# EAGLE schematic LEDtable (EAGLE 7.5.0)
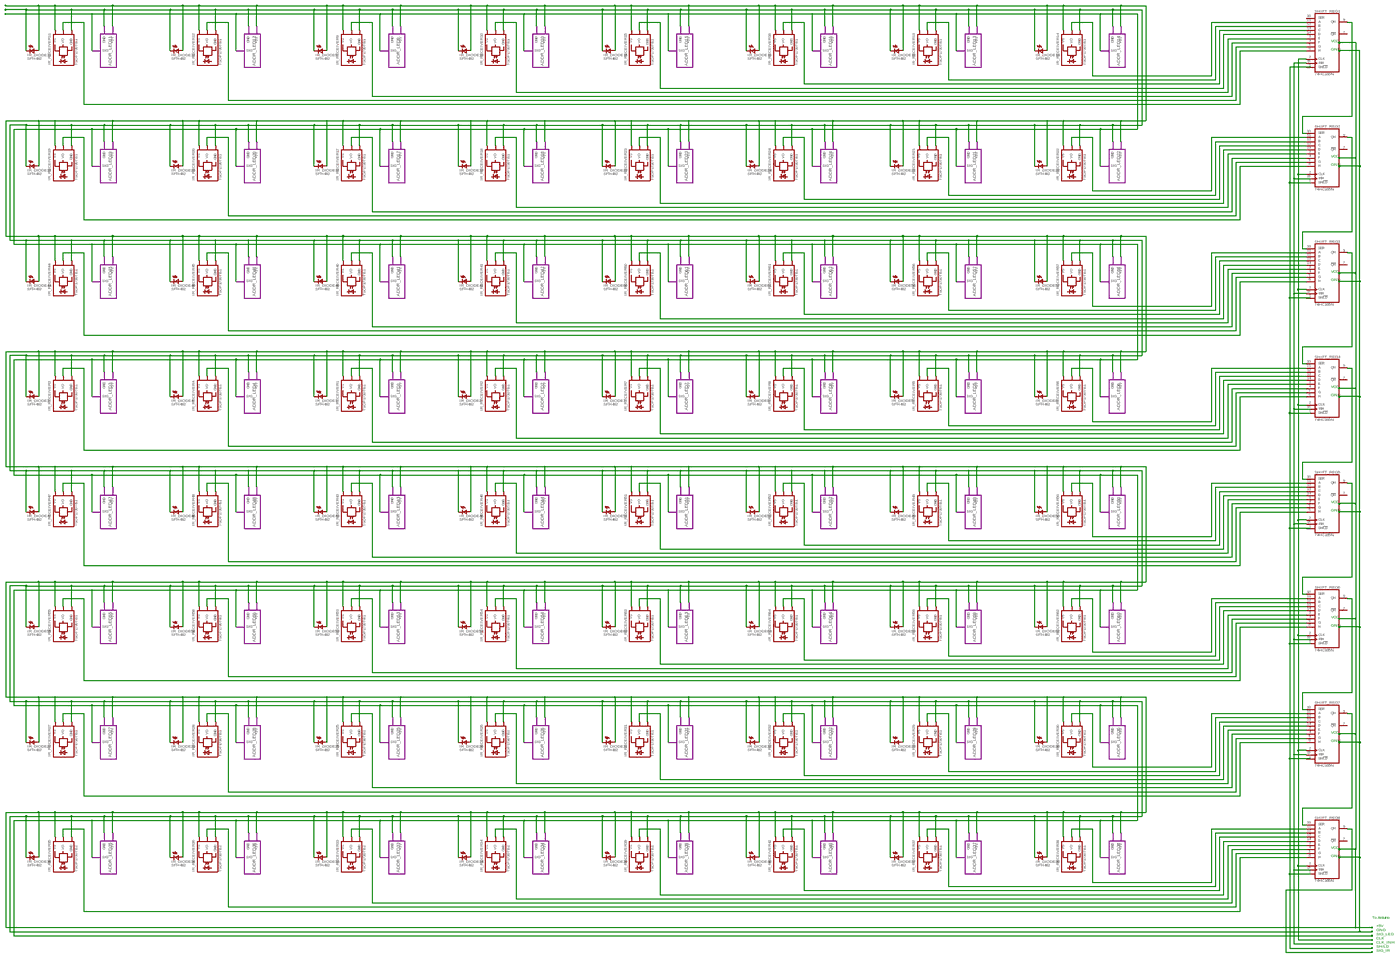
[diagram p0: schematic, sheet 1, overview]
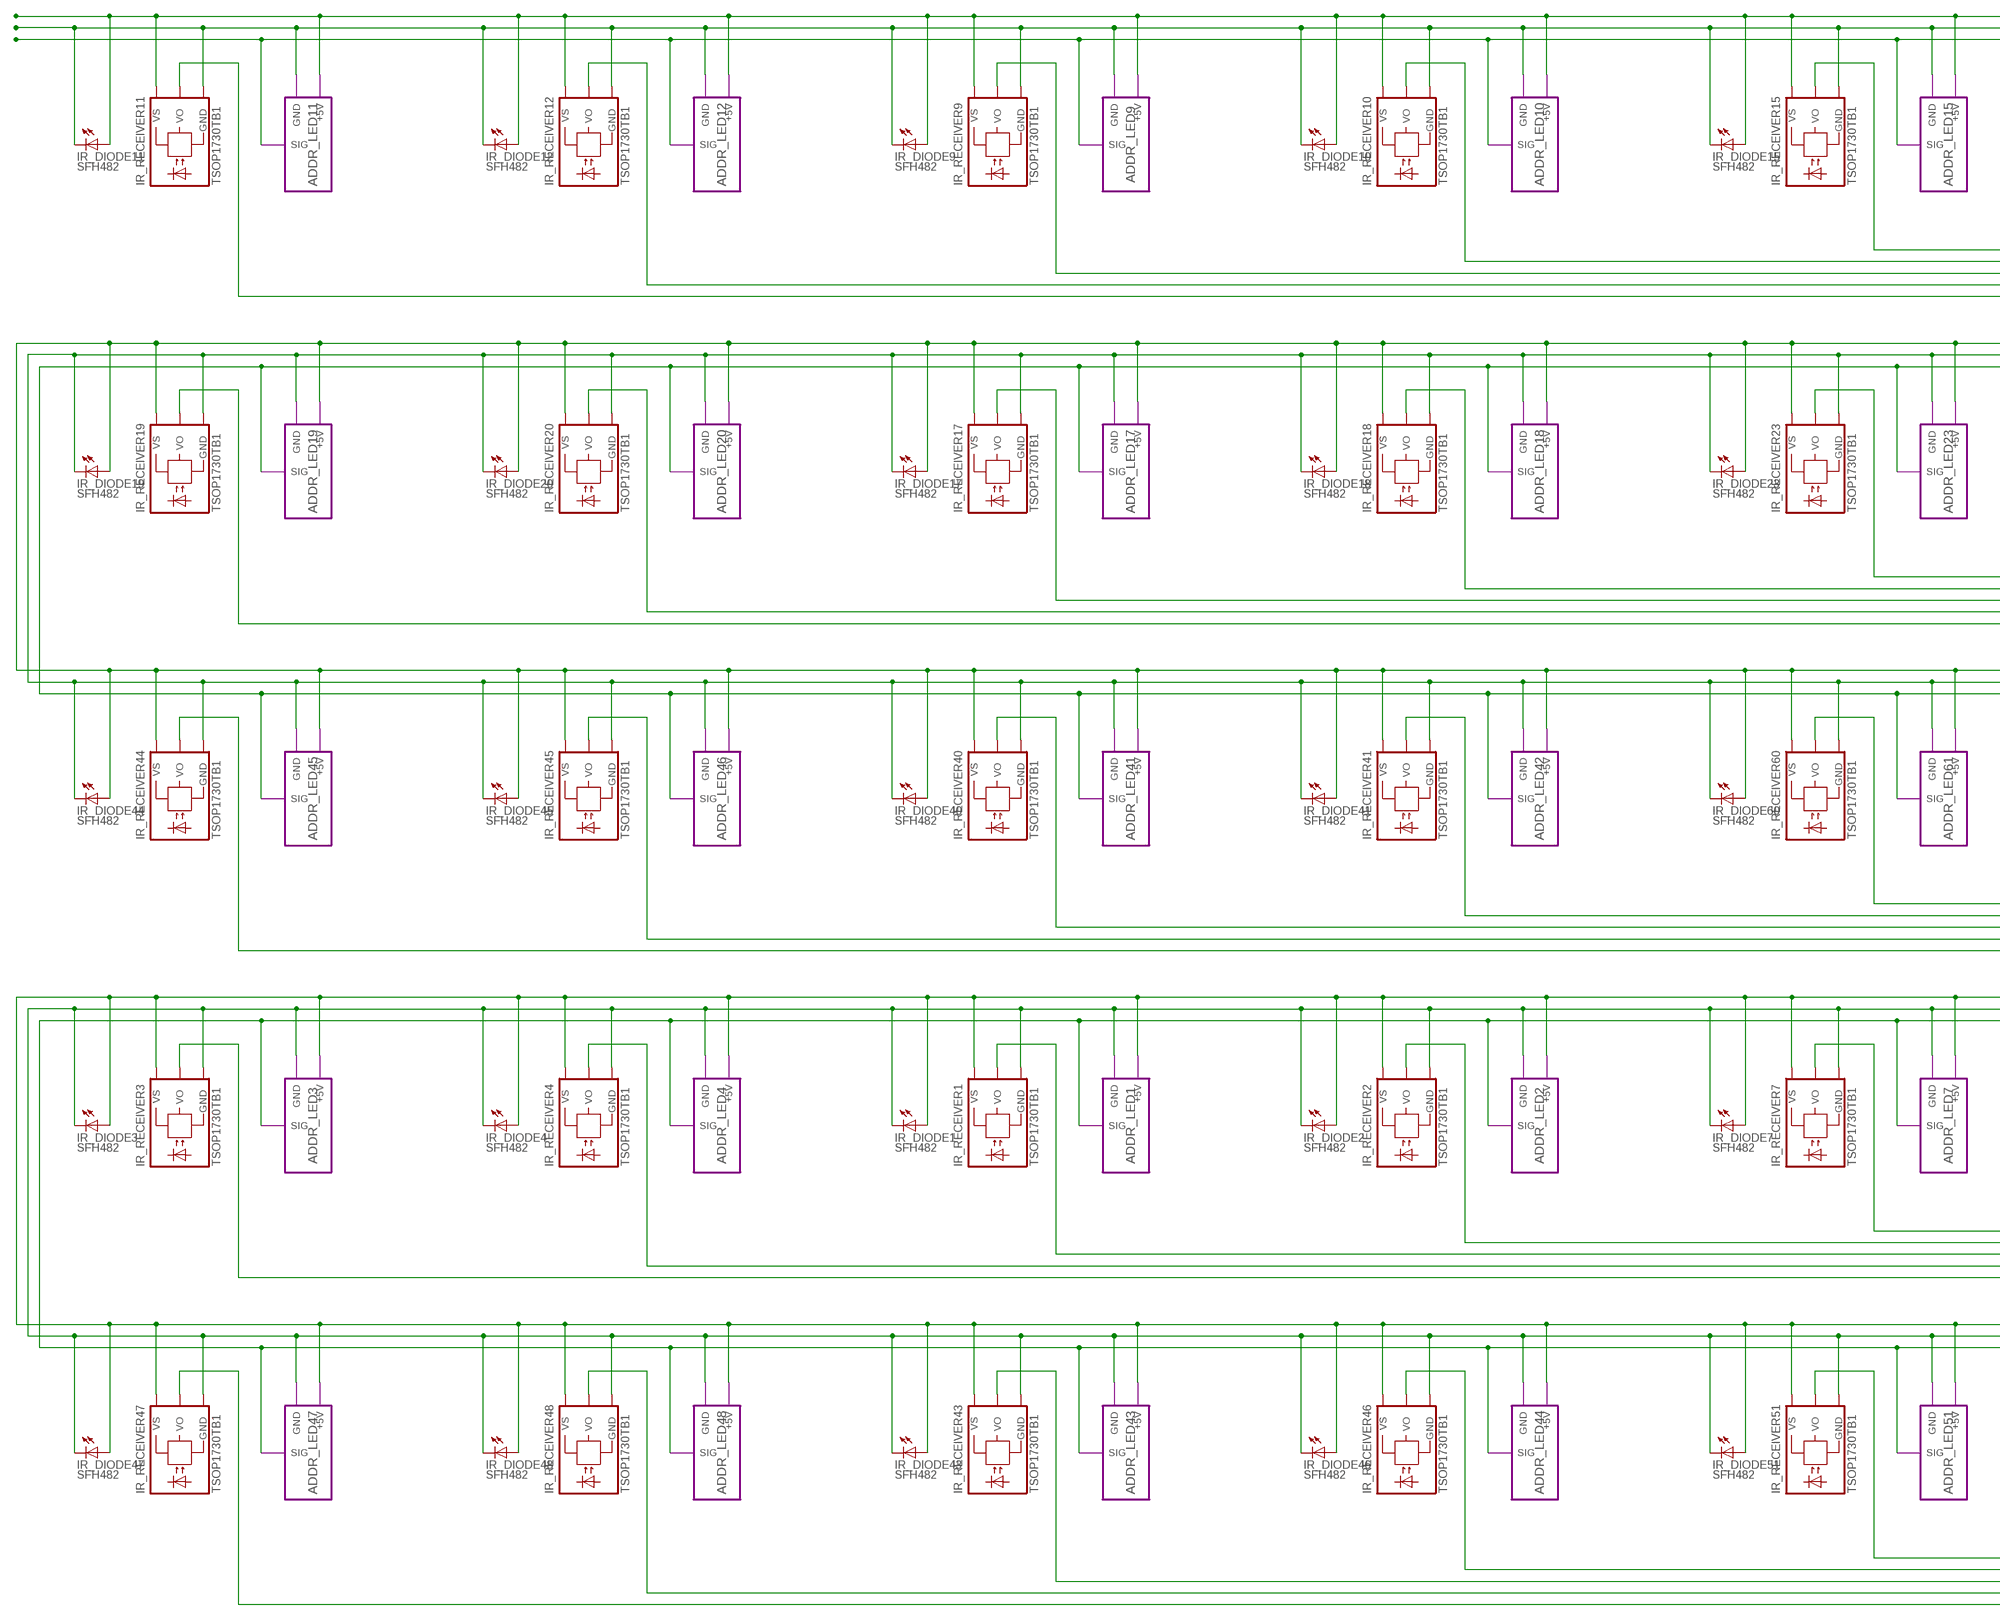
[diagram p1: schematic, sheet 1, part 1 of 4]
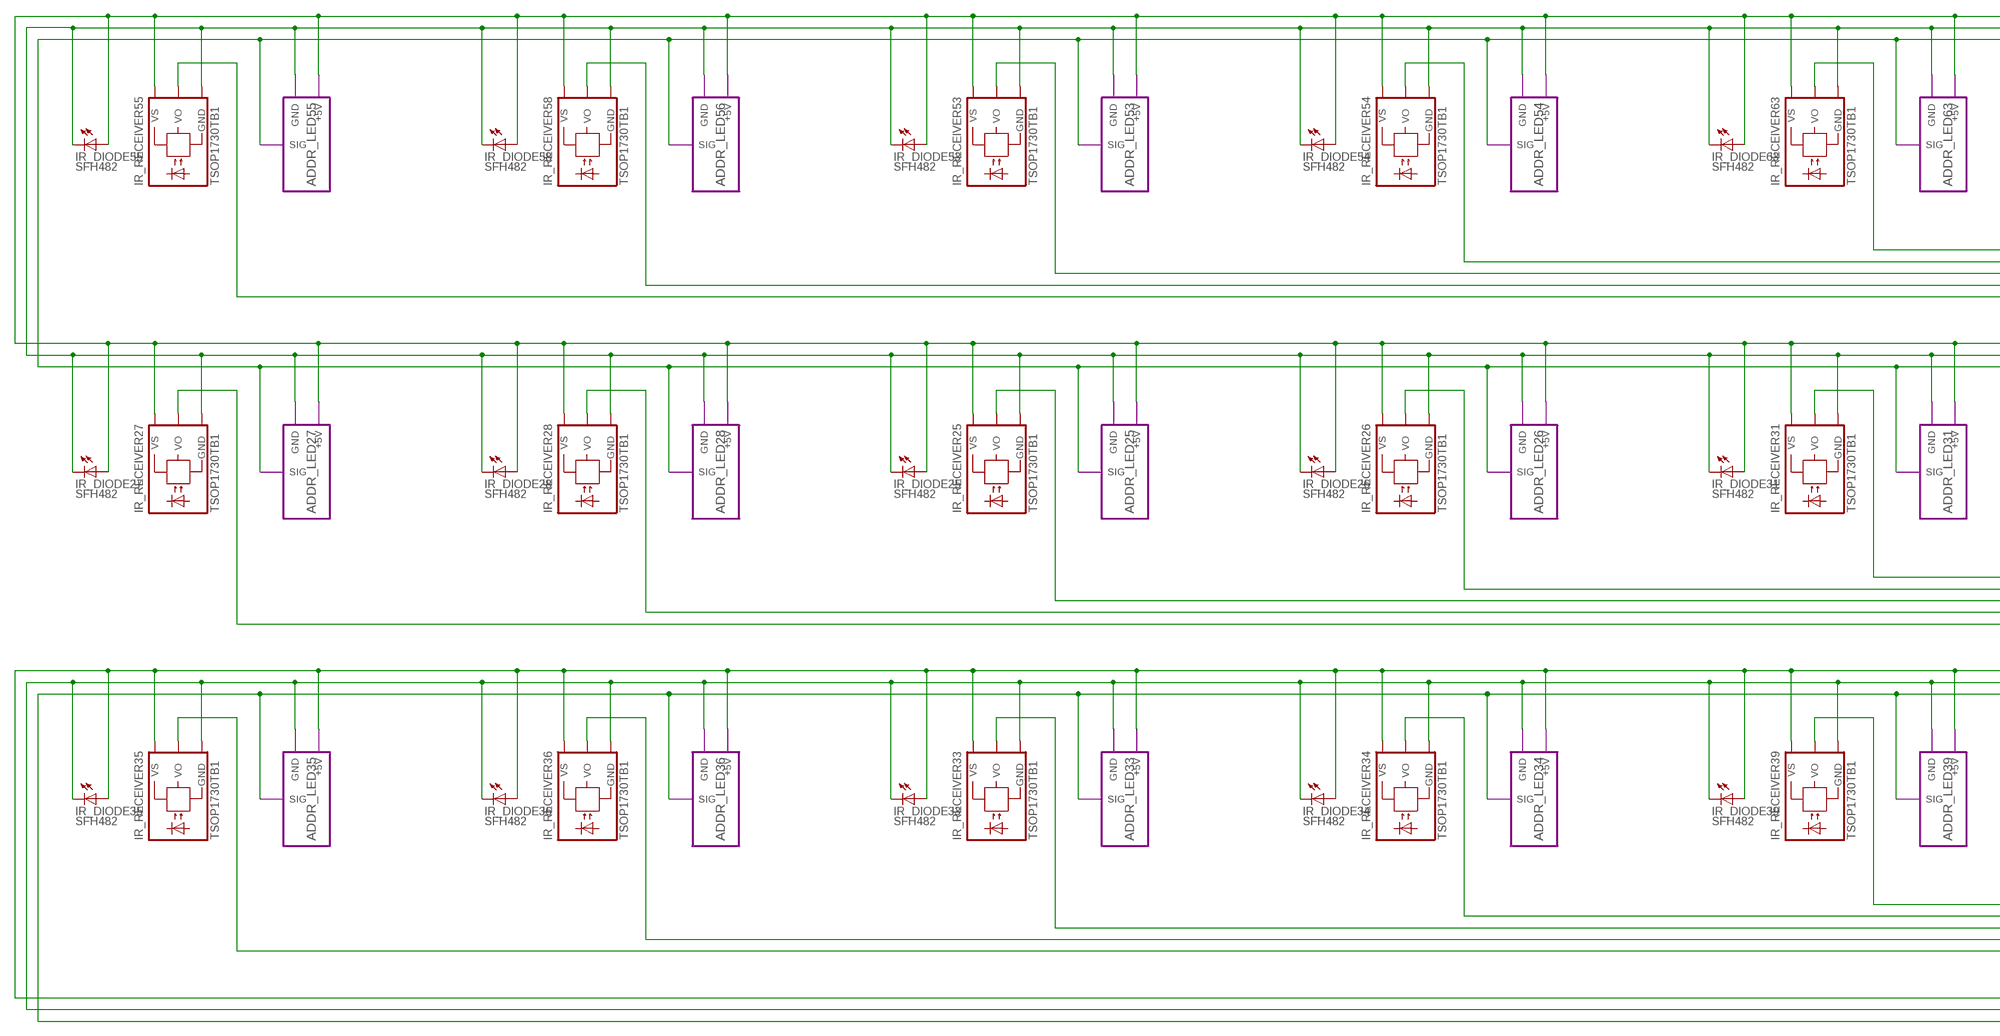
[diagram p2: schematic, sheet 1, part 2 of 4]
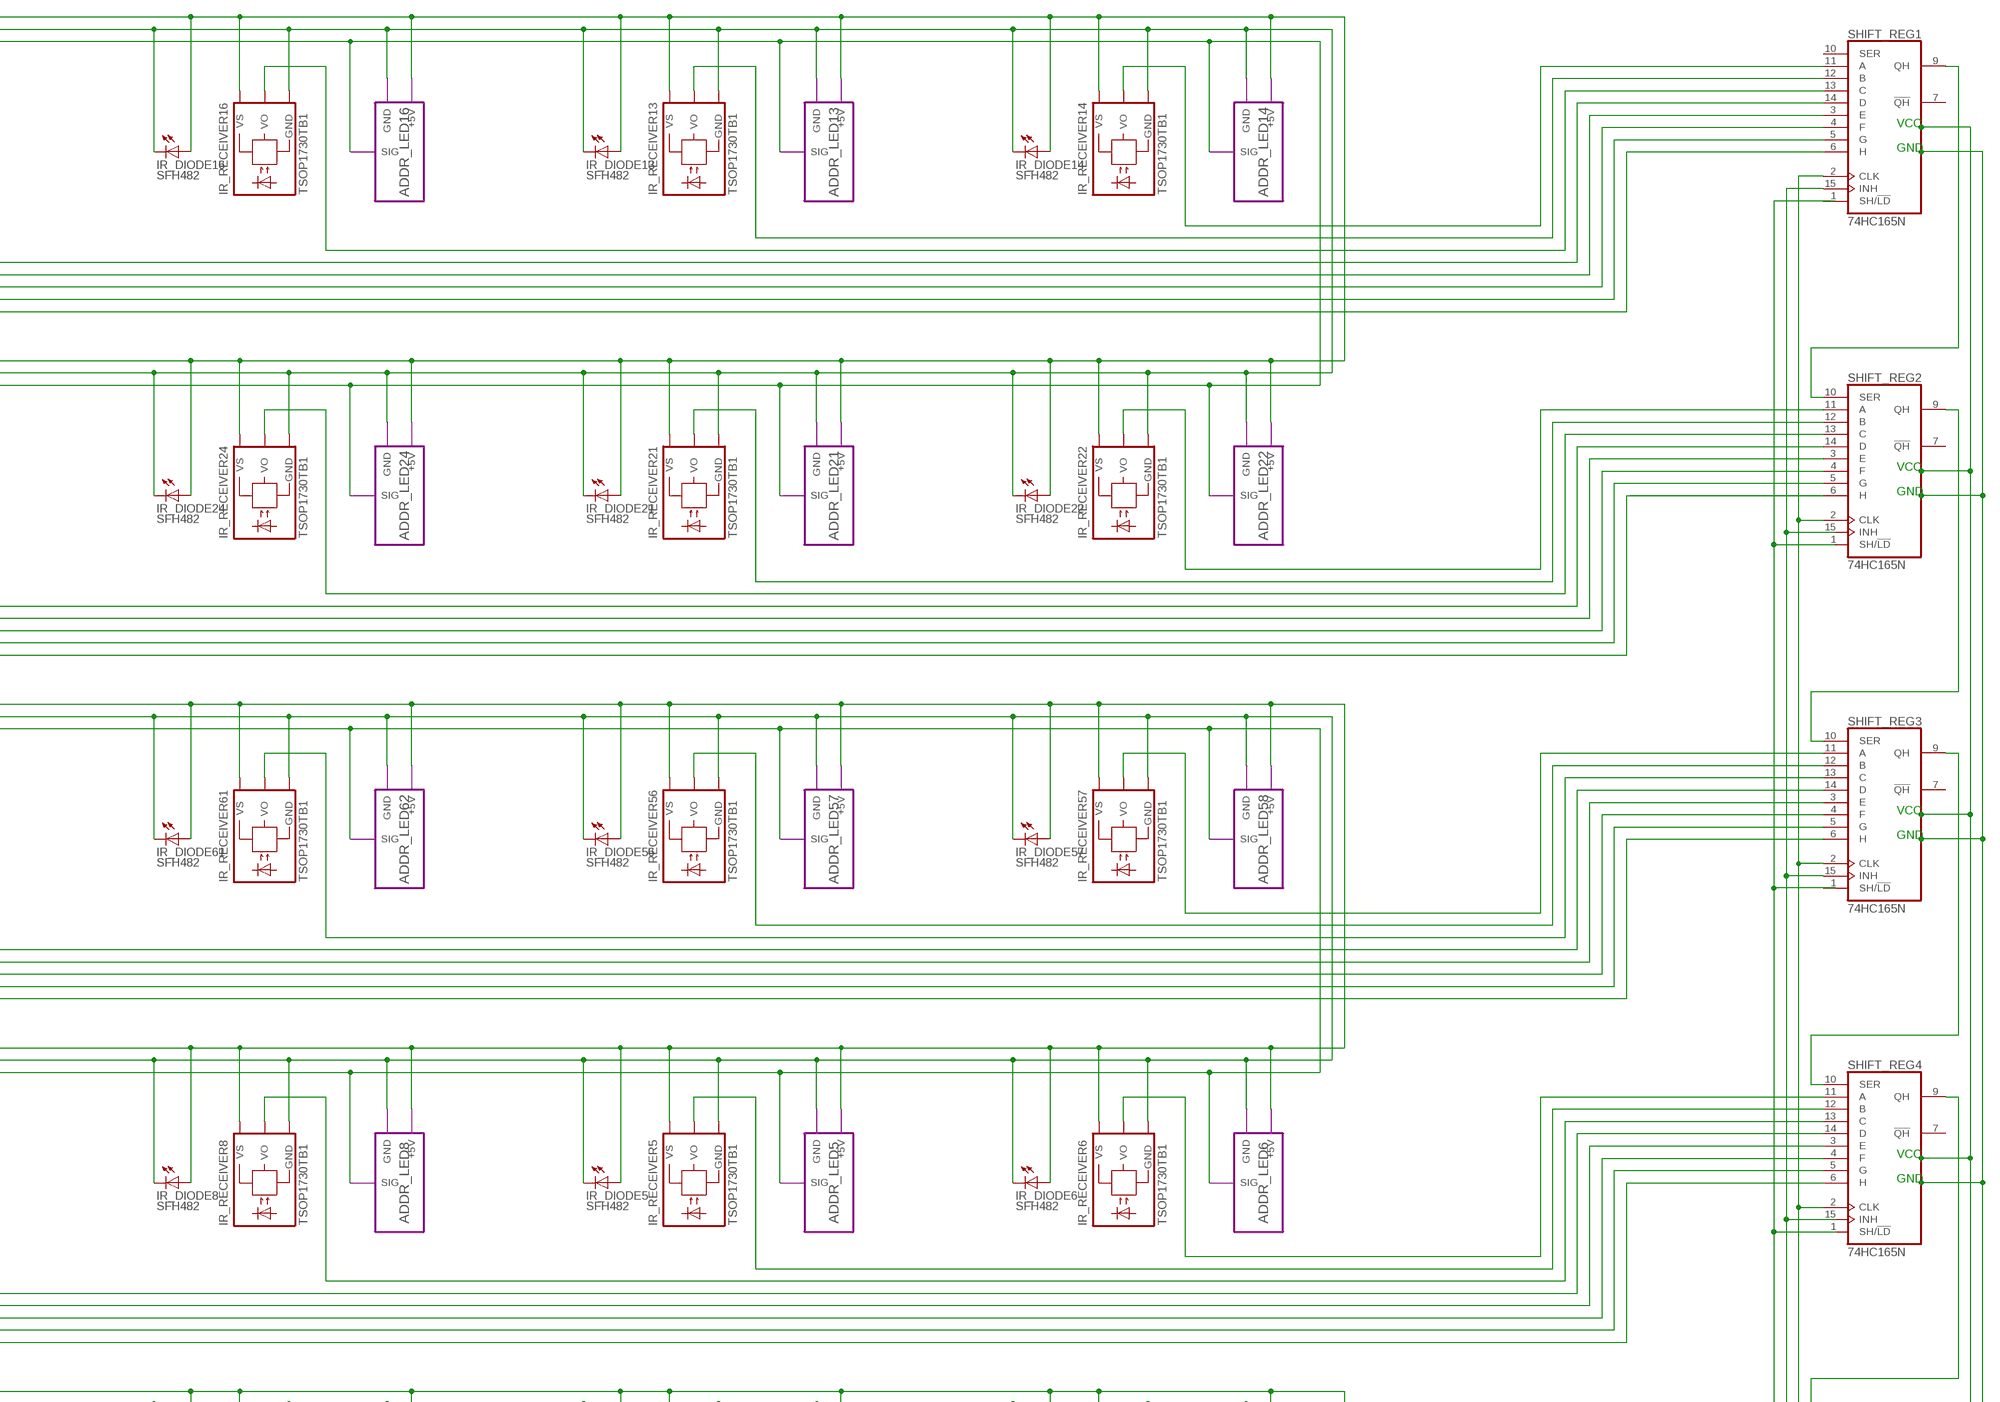
[diagram p3: schematic, sheet 1, part 3 of 4]
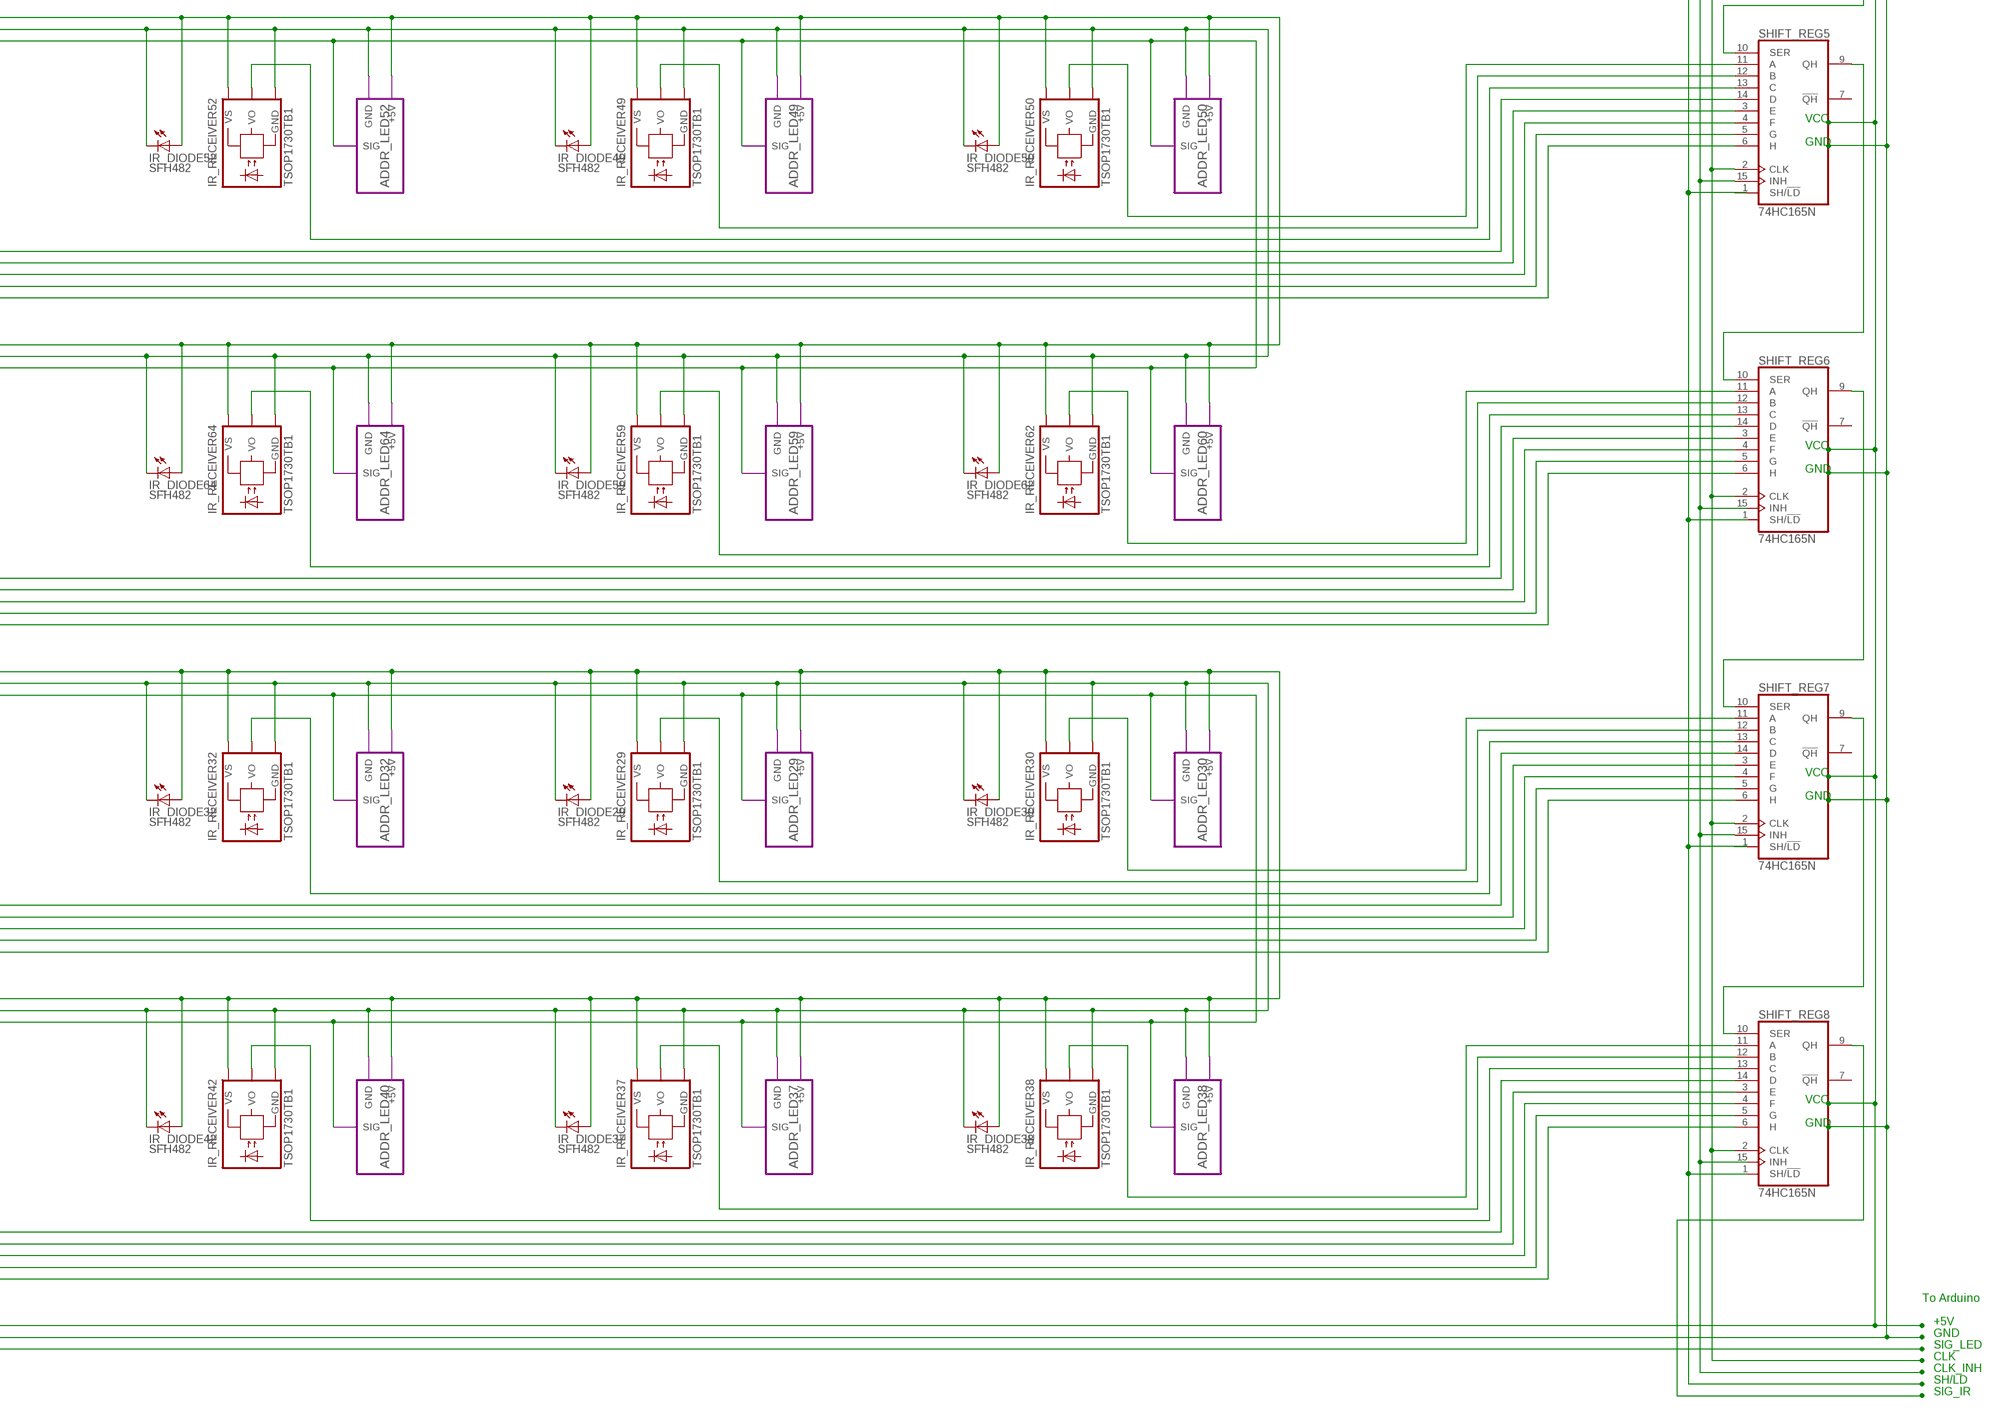
[diagram p4: schematic, sheet 1, part 4 of 4]

## Parts
IR_DIODE1  SFH482  [SFH482]
IR_DIODE2  SFH482  [SFH482]
IR_DIODE3  SFH482  [SFH482]
IR_DIODE4  SFH482  [SFH482]
IR_DIODE5  SFH482  [SFH482]
IR_DIODE6  SFH482  [SFH482]
IR_DIODE7  SFH482  [SFH482]
IR_DIODE8  SFH482  [SFH482]
IR_DIODE9  SFH482  [SFH482]
IR_DIODE10  SFH482  [SFH482]
IR_DIODE11  SFH482  [SFH482]
IR_DIODE12  SFH482  [SFH482]
IR_DIODE13  SFH482  [SFH482]
IR_DIODE14  SFH482  [SFH482]
IR_DIODE15  SFH482  [SFH482]
IR_DIODE16  SFH482  [SFH482]
IR_DIODE17  SFH482  [SFH482]
IR_DIODE18  SFH482  [SFH482]
IR_DIODE19  SFH482  [SFH482]
IR_DIODE20  SFH482  [SFH482]
IR_DIODE21  SFH482  [SFH482]
IR_DIODE22  SFH482  [SFH482]
IR_DIODE23  SFH482  [SFH482]
IR_DIODE24  SFH482  [SFH482]
IR_DIODE25  SFH482  [SFH482]
IR_DIODE26  SFH482  [SFH482]
IR_DIODE27  SFH482  [SFH482]
IR_DIODE28  SFH482  [SFH482]
IR_DIODE29  SFH482  [SFH482]
IR_DIODE30  SFH482  [SFH482]
IR_DIODE31  SFH482  [SFH482]
IR_DIODE32  SFH482  [SFH482]
IR_DIODE33  SFH482  [SFH482]
IR_DIODE34  SFH482  [SFH482]
IR_DIODE35  SFH482  [SFH482]
IR_DIODE36  SFH482  [SFH482]
IR_DIODE37  SFH482  [SFH482]
IR_DIODE38  SFH482  [SFH482]
IR_DIODE39  SFH482  [SFH482]
IR_DIODE40  SFH482  [SFH482]
IR_DIODE41  SFH482  [SFH482]
IR_DIODE42  SFH482  [SFH482]
IR_DIODE43  SFH482  [SFH482]
IR_DIODE44  SFH482  [SFH482]
IR_DIODE45  SFH482  [SFH482]
IR_DIODE46  SFH482  [SFH482]
IR_DIODE47  SFH482  [SFH482]
IR_DIODE48  SFH482  [SFH482]
IR_DIODE49  SFH482  [SFH482]
IR_DIODE50  SFH482  [SFH482]
IR_DIODE51  SFH482  [SFH482]
IR_DIODE52  SFH482  [SFH482]
IR_DIODE53  SFH482  [SFH482]
IR_DIODE54  SFH482  [SFH482]
IR_DIODE55  SFH482  [SFH482]
IR_DIODE56  SFH482  [SFH482]
IR_DIODE57  SFH482  [SFH482]
IR_DIODE58  SFH482  [SFH482]
IR_DIODE59  SFH482  [SFH482]
IR_DIODE60  SFH482  [SFH482]
IR_DIODE61  SFH482  [SFH482]
IR_DIODE62  SFH482  [SFH482]
IR_DIODE63  SFH482  [SFH482]
IR_DIODE64  SFH482  [SFH482]
IR_RECEIVER1  TSOP1730TB1  [TSOP17_TB1]
IR_RECEIVER2  TSOP1730TB1  [TSOP17_TB1]
IR_RECEIVER3  TSOP1730TB1  [TSOP17_TB1]
IR_RECEIVER4  TSOP1730TB1  [TSOP17_TB1]
IR_RECEIVER5  TSOP1730TB1  [TSOP17_TB1]
IR_RECEIVER6  TSOP1730TB1  [TSOP17_TB1]
IR_RECEIVER7  TSOP1730TB1  [TSOP17_TB1]
IR_RECEIVER8  TSOP1730TB1  [TSOP17_TB1]
IR_RECEIVER9  TSOP1730TB1  [TSOP17_TB1]
IR_RECEIVER10  TSOP1730TB1  [TSOP17_TB1]
IR_RECEIVER11  TSOP1730TB1  [TSOP17_TB1]
IR_RECEIVER12  TSOP1730TB1  [TSOP17_TB1]
IR_RECEIVER13  TSOP1730TB1  [TSOP17_TB1]
IR_RECEIVER14  TSOP1730TB1  [TSOP17_TB1]
IR_RECEIVER15  TSOP1730TB1  [TSOP17_TB1]
IR_RECEIVER16  TSOP1730TB1  [TSOP17_TB1]
IR_RECEIVER17  TSOP1730TB1  [TSOP17_TB1]
IR_RECEIVER18  TSOP1730TB1  [TSOP17_TB1]
IR_RECEIVER19  TSOP1730TB1  [TSOP17_TB1]
IR_RECEIVER20  TSOP1730TB1  [TSOP17_TB1]
IR_RECEIVER21  TSOP1730TB1  [TSOP17_TB1]
IR_RECEIVER22  TSOP1730TB1  [TSOP17_TB1]
IR_RECEIVER23  TSOP1730TB1  [TSOP17_TB1]
IR_RECEIVER24  TSOP1730TB1  [TSOP17_TB1]
IR_RECEIVER25  TSOP1730TB1  [TSOP17_TB1]
IR_RECEIVER26  TSOP1730TB1  [TSOP17_TB1]
IR_RECEIVER27  TSOP1730TB1  [TSOP17_TB1]
IR_RECEIVER28  TSOP1730TB1  [TSOP17_TB1]
IR_RECEIVER29  TSOP1730TB1  [TSOP17_TB1]
IR_RECEIVER30  TSOP1730TB1  [TSOP17_TB1]
IR_RECEIVER31  TSOP1730TB1  [TSOP17_TB1]
IR_RECEIVER32  TSOP1730TB1  [TSOP17_TB1]
IR_RECEIVER33  TSOP1730TB1  [TSOP17_TB1]
IR_RECEIVER34  TSOP1730TB1  [TSOP17_TB1]
IR_RECEIVER35  TSOP1730TB1  [TSOP17_TB1]
IR_RECEIVER36  TSOP1730TB1  [TSOP17_TB1]
IR_RECEIVER37  TSOP1730TB1  [TSOP17_TB1]
IR_RECEIVER38  TSOP1730TB1  [TSOP17_TB1]
IR_RECEIVER39  TSOP1730TB1  [TSOP17_TB1]
IR_RECEIVER40  TSOP1730TB1  [TSOP17_TB1]
IR_RECEIVER41  TSOP1730TB1  [TSOP17_TB1]
IR_RECEIVER42  TSOP1730TB1  [TSOP17_TB1]
IR_RECEIVER43  TSOP1730TB1  [TSOP17_TB1]
IR_RECEIVER44  TSOP1730TB1  [TSOP17_TB1]
IR_RECEIVER45  TSOP1730TB1  [TSOP17_TB1]
IR_RECEIVER46  TSOP1730TB1  [TSOP17_TB1]
IR_RECEIVER47  TSOP1730TB1  [TSOP17_TB1]
IR_RECEIVER48  TSOP1730TB1  [TSOP17_TB1]
IR_RECEIVER49  TSOP1730TB1  [TSOP17_TB1]
IR_RECEIVER50  TSOP1730TB1  [TSOP17_TB1]
IR_RECEIVER51  TSOP1730TB1  [TSOP17_TB1]
IR_RECEIVER52  TSOP1730TB1  [TSOP17_TB1]
IR_RECEIVER53  TSOP1730TB1  [TSOP17_TB1]
IR_RECEIVER54  TSOP1730TB1  [TSOP17_TB1]
IR_RECEIVER55  TSOP1730TB1  [TSOP17_TB1]
IR_RECEIVER56  TSOP1730TB1  [TSOP17_TB1]
IR_RECEIVER57  TSOP1730TB1  [TSOP17_TB1]
IR_RECEIVER58  TSOP1730TB1  [TSOP17_TB1]
IR_RECEIVER59  TSOP1730TB1  [TSOP17_TB1]
IR_RECEIVER60  TSOP1730TB1  [TSOP17_TB1]
IR_RECEIVER61  TSOP1730TB1  [TSOP17_TB1]
IR_RECEIVER62  TSOP1730TB1  [TSOP17_TB1]
IR_RECEIVER63  TSOP1730TB1  [TSOP17_TB1]
IR_RECEIVER64  TSOP1730TB1  [TSOP17_TB1]
SHIFT_REG1  74HC165N  [DIL16]
SHIFT_REG2  74HC165N  [DIL16]
SHIFT_REG3  74HC165N  [DIL16]
SHIFT_REG4  74HC165N  [DIL16]
SHIFT_REG5  74HC165N  [DIL16]
SHIFT_REG6  74HC165N  [DIL16]
SHIFT_REG7  74HC165N  [DIL16]
SHIFT_REG8  74HC165N  [DIL16]

## Module instances
ADDR_LED41 = ADDR_LED
ADDR_LED42 = ADDR_LED
ADDR_LED45 = ADDR_LED
ADDR_LED46 = ADDR_LED
ADDR_LED57 = ADDR_LED
ADDR_LED58 = ADDR_LED
ADDR_LED61 = ADDR_LED
ADDR_LED62 = ADDR_LED
ADDR_LED1 = ADDR_LED
ADDR_LED2 = ADDR_LED
ADDR_LED3 = ADDR_LED
ADDR_LED4 = ADDR_LED
ADDR_LED5 = ADDR_LED
ADDR_LED6 = ADDR_LED
ADDR_LED7 = ADDR_LED
ADDR_LED8 = ADDR_LED
ADDR_LED9 = ADDR_LED
ADDR_LED10 = ADDR_LED
ADDR_LED11 = ADDR_LED
ADDR_LED12 = ADDR_LED
ADDR_LED13 = ADDR_LED
ADDR_LED14 = ADDR_LED
ADDR_LED15 = ADDR_LED
ADDR_LED16 = ADDR_LED
ADDR_LED17 = ADDR_LED
ADDR_LED18 = ADDR_LED
ADDR_LED19 = ADDR_LED
ADDR_LED20 = ADDR_LED
ADDR_LED21 = ADDR_LED
ADDR_LED22 = ADDR_LED
ADDR_LED23 = ADDR_LED
ADDR_LED24 = ADDR_LED
ADDR_LED25 = ADDR_LED
ADDR_LED26 = ADDR_LED
ADDR_LED27 = ADDR_LED
ADDR_LED28 = ADDR_LED
ADDR_LED29 = ADDR_LED
ADDR_LED30 = ADDR_LED
ADDR_LED31 = ADDR_LED
ADDR_LED32 = ADDR_LED
ADDR_LED33 = ADDR_LED
ADDR_LED34 = ADDR_LED
ADDR_LED35 = ADDR_LED
ADDR_LED36 = ADDR_LED
ADDR_LED37 = ADDR_LED
ADDR_LED38 = ADDR_LED
ADDR_LED39 = ADDR_LED
ADDR_LED40 = ADDR_LED
ADDR_LED43 = ADDR_LED
ADDR_LED44 = ADDR_LED
ADDR_LED47 = ADDR_LED
ADDR_LED48 = ADDR_LED
ADDR_LED49 = ADDR_LED
ADDR_LED50 = ADDR_LED
ADDR_LED51 = ADDR_LED
ADDR_LED52 = ADDR_LED
ADDR_LED53 = ADDR_LED
ADDR_LED54 = ADDR_LED
ADDR_LED55 = ADDR_LED
ADDR_LED56 = ADDR_LED
ADDR_LED59 = ADDR_LED
ADDR_LED60 = ADDR_LED
ADDR_LED63 = ADDR_LED
ADDR_LED64 = ADDR_LED

## Nets
+5V: IR_DIODE1.A IR_DIODE2.A IR_DIODE3.A IR_DIODE4.A IR_DIODE5.A IR_DIODE6.A IR_DIODE7.A IR_DIODE8.A IR_DIODE9.A IR_DIODE10.A IR_DIODE11.A IR_DIODE12.A IR_DIODE13.A IR_DIODE14.A IR_DIODE15.A IR_DIODE16.A IR_DIODE17.A IR_DIODE18.A IR_DIODE19.A IR_DIODE20.A IR_DIODE21.A IR_DIODE22.A IR_DIODE23.A IR_DIODE24.A IR_DIODE25.A IR_DIODE26.A IR_DIODE27.A IR_DIODE28.A IR_DIODE29.A IR_DIODE30.A IR_DIODE31.A IR_DIODE32.A IR_DIODE33.A IR_DIODE34.A IR_DIODE35.A IR_DIODE36.A IR_DIODE37.A IR_DIODE38.A IR_DIODE39.A IR_DIODE40.A IR_DIODE41.A IR_DIODE42.A IR_DIODE43.A IR_DIODE44.A IR_DIODE45.A IR_DIODE46.A IR_DIODE47.A IR_DIODE48.A IR_DIODE49.A IR_DIODE50.A IR_DIODE51.A IR_DIODE52.A IR_DIODE53.A IR_DIODE54.A IR_DIODE55.A IR_DIODE56.A IR_DIODE57.A IR_DIODE58.A IR_DIODE59.A IR_DIODE60.A IR_DIODE61.A IR_DIODE62.A IR_DIODE63.A IR_DIODE64.A IR_RECEIVER1.VS IR_RECEIVER2.VS IR_RECEIVER3.VS IR_RECEIVER4.VS IR_RECEIVER5.VS IR_RECEIVER6.VS IR_RECEIVER7.VS IR_RECEIVER8.VS IR_RECEIVER9.VS IR_RECEIVER10.VS IR_RECEIVER11.VS IR_RECEIVER12.VS IR_RECEIVER13.VS IR_RECEIVER14.VS IR_RECEIVER15.VS IR_RECEIVER16.VS IR_RECEIVER17.VS IR_RECEIVER18.VS IR_RECEIVER19.VS IR_RECEIVER20.VS IR_RECEIVER21.VS IR_RECEIVER22.VS IR_RECEIVER23.VS IR_RECEIVER24.VS IR_RECEIVER25.VS IR_RECEIVER26.VS IR_RECEIVER27.VS IR_RECEIVER28.VS IR_RECEIVER29.VS IR_RECEIVER30.VS IR_RECEIVER31.VS IR_RECEIVER32.VS IR_RECEIVER33.VS IR_RECEIVER34.VS IR_RECEIVER35.VS IR_RECEIVER36.VS IR_RECEIVER37.VS IR_RECEIVER38.VS IR_RECEIVER39.VS IR_RECEIVER40.VS IR_RECEIVER41.VS IR_RECEIVER42.VS IR_RECEIVER43.VS IR_RECEIVER44.VS IR_RECEIVER45.VS IR_RECEIVER46.VS IR_RECEIVER47.VS IR_RECEIVER48.VS IR_RECEIVER49.VS IR_RECEIVER50.VS IR_RECEIVER51.VS IR_RECEIVER52.VS IR_RECEIVER53.VS IR_RECEIVER54.VS IR_RECEIVER55.VS IR_RECEIVER56.VS IR_RECEIVER57.VS IR_RECEIVER58.VS IR_RECEIVER59.VS IR_RECEIVER60.VS IR_RECEIVER61.VS IR_RECEIVER62.VS IR_RECEIVER63.VS IR_RECEIVER64.VS ; port ADDR_LED11.+5V ADDR_LED12.+5V ADDR_LED9.+5V ADDR_LED10.+5V ADDR_LED15.+5V ADDR_LED16.+5V ADDR_LED13.+5V ADDR_LED14.+5V ADDR_LED19.+5V ADDR_LED20.+5V ADDR_LED17.+5V ADDR_LED18.+5V ADDR_LED23.+5V ADDR_LED24.+5V ADDR_LED21.+5V ADDR_LED22.+5V ADDR_LED45.+5V ADDR_LED46.+5V ADDR_LED41.+5V ADDR_LED42.+5V ADDR_LED61.+5V ADDR_LED62.+5V ADDR_LED57.+5V ADDR_LED58.+5V ADDR_LED3.+5V ADDR_LED4.+5V ADDR_LED1.+5V ADDR_LED2.+5V ADDR_LED7.+5V ADDR_LED8.+5V ADDR_LED5.+5V ADDR_LED6.+5V ADDR_LED47.+5V ADDR_LED48.+5V ADDR_LED43.+5V ADDR_LED44.+5V ADDR_LED51.+5V ADDR_LED52.+5V ADDR_LED49.+5V ADDR_LED50.+5V ADDR_LED55.+5V ADDR_LED56.+5V ADDR_LED53.+5V ADDR_LED54.+5V ADDR_LED63.+5V ADDR_LED64.+5V ADDR_LED59.+5V ADDR_LED60.+5V ADDR_LED27.+5V ADDR_LED28.+5V ADDR_LED25.+5V ADDR_LED26.+5V ADDR_LED31.+5V ADDR_LED32.+5V ADDR_LED29.+5V ADDR_LED30.+5V ADDR_LED35.+5V ADDR_LED36.+5V ADDR_LED33.+5V ADDR_LED34.+5V ADDR_LED39.+5V ADDR_LED40.+5V ADDR_LED37.+5V ADDR_LED38.+5V
CLK: SHIFT_REG1.2(CLK) SHIFT_REG2.2(CLK) SHIFT_REG3.2(CLK) SHIFT_REG4.2(CLK) SHIFT_REG5.2(CLK) SHIFT_REG6.2(CLK) SHIFT_REG7.2(CLK) SHIFT_REG8.2(CLK)
CLK_INH: SHIFT_REG1.15(INH) SHIFT_REG3.15(INH) SHIFT_REG5.15(INH) SHIFT_REG7.15(INH)
GND: IR_DIODE1.K(C) IR_DIODE2.K(C) IR_DIODE3.K(C) IR_DIODE4.K(C) IR_DIODE5.K(C) IR_DIODE6.K(C) IR_DIODE7.K(C) IR_DIODE8.K(C) IR_DIODE9.K(C) IR_DIODE10.K(C) IR_DIODE11.K(C) IR_DIODE12.K(C) IR_DIODE13.K(C) IR_DIODE14.K(C) IR_DIODE15.K(C) IR_DIODE16.K(C) IR_DIODE17.K(C) IR_DIODE18.K(C) IR_DIODE19.K(C) IR_DIODE20.K(C) IR_DIODE21.K(C) IR_DIODE22.K(C) IR_DIODE23.K(C) IR_DIODE24.K(C) IR_DIODE25.K(C) IR_DIODE26.K(C) IR_DIODE27.K(C) IR_DIODE28.K(C) IR_DIODE29.K(C) IR_DIODE30.K(C) IR_DIODE31.K(C) IR_DIODE32.K(C) IR_DIODE33.K(C) IR_DIODE34.K(C) IR_DIODE35.K(C) IR_DIODE36.K(C) IR_DIODE37.K(C) IR_DIODE38.K(C) IR_DIODE39.K(C) IR_DIODE40.K(C) IR_DIODE41.K(C) IR_DIODE42.K(C) IR_DIODE43.K(C) IR_DIODE44.K(C) IR_DIODE45.K(C) IR_DIODE46.K(C) IR_DIODE47.K(C) IR_DIODE48.K(C) IR_DIODE49.K(C) IR_DIODE50.K(C) IR_DIODE51.K(C) IR_DIODE52.K(C) IR_DIODE53.K(C) IR_DIODE54.K(C) IR_DIODE55.K(C) IR_DIODE56.K(C) IR_DIODE57.K(C) IR_DIODE58.K(C) IR_DIODE59.K(C) IR_DIODE60.K(C) IR_DIODE61.K(C) IR_DIODE62.K(C) IR_DIODE63.K(C) IR_DIODE64.K(C) IR_RECEIVER1.GND IR_RECEIVER2.GND IR_RECEIVER3.GND IR_RECEIVER4.GND IR_RECEIVER5.GND IR_RECEIVER6.GND IR_RECEIVER7.GND IR_RECEIVER8.GND IR_RECEIVER9.GND IR_RECEIVER10.GND IR_RECEIVER11.GND IR_RECEIVER12.GND IR_RECEIVER13.GND IR_RECEIVER14.GND IR_RECEIVER15.GND IR_RECEIVER16.GND IR_RECEIVER17.GND IR_RECEIVER18.GND IR_RECEIVER19.GND IR_RECEIVER20.GND IR_RECEIVER21.GND IR_RECEIVER22.GND IR_RECEIVER23.GND IR_RECEIVER24.GND IR_RECEIVER25.GND IR_RECEIVER26.GND IR_RECEIVER27.GND IR_RECEIVER28.GND IR_RECEIVER29.GND IR_RECEIVER30.GND IR_RECEIVER31.GND IR_RECEIVER32.GND IR_RECEIVER33.GND IR_RECEIVER34.GND IR_RECEIVER35.GND IR_RECEIVER36.GND IR_RECEIVER37.GND IR_RECEIVER38.GND IR_RECEIVER39.GND IR_RECEIVER40.GND IR_RECEIVER41.GND IR_RECEIVER42.GND IR_RECEIVER43.GND IR_RECEIVER44.GND IR_RECEIVER45.GND IR_RECEIVER46.GND IR_RECEIVER47.GND IR_RECEIVER48.GND IR_RECEIVER49.GND IR_RECEIVER50.GND IR_RECEIVER51.GND IR_RECEIVER52.GND IR_RECEIVER53.GND IR_RECEIVER54.GND IR_RECEIVER55.GND IR_RECEIVER56.GND IR_RECEIVER57.GND IR_RECEIVER58.GND IR_RECEIVER59.GND IR_RECEIVER60.GND IR_RECEIVER61.GND IR_RECEIVER62.GND IR_RECEIVER63.GND IR_RECEIVER64.GND ; port ADDR_LED11.GND ADDR_LED12.GND ADDR_LED9.GND ADDR_LED10.GND ADDR_LED15.GND ADDR_LED16.GND ADDR_LED13.GND ADDR_LED14.GND ADDR_LED19.GND ADDR_LED20.GND ADDR_LED17.GND ADDR_LED18.GND ADDR_LED23.GND ADDR_LED24.GND ADDR_LED21.GND ADDR_LED22.GND ADDR_LED45.GND ADDR_LED46.GND ADDR_LED41.GND ADDR_LED42.GND ADDR_LED61.GND ADDR_LED62.GND ADDR_LED57.GND ADDR_LED58.GND ADDR_LED3.GND ADDR_LED4.GND ADDR_LED1.GND ADDR_LED2.GND ADDR_LED7.GND ADDR_LED8.GND ADDR_LED5.GND ADDR_LED6.GND ADDR_LED47.GND ADDR_LED48.GND ADDR_LED43.GND ADDR_LED44.GND ADDR_LED51.GND ADDR_LED52.GND ADDR_LED49.GND ADDR_LED50.GND ADDR_LED55.GND ADDR_LED56.GND ADDR_LED53.GND ADDR_LED54.GND ADDR_LED63.GND ADDR_LED64.GND ADDR_LED59.GND ADDR_LED60.GND ADDR_LED27.GND ADDR_LED28.GND ADDR_LED25.GND ADDR_LED26.GND ADDR_LED31.GND ADDR_LED32.GND ADDR_LED29.GND ADDR_LED30.GND ADDR_LED35.GND ADDR_LED36.GND ADDR_LED33.GND ADDR_LED34.GND ADDR_LED39.GND ADDR_LED40.GND ADDR_LED37.GND ADDR_LED38.GND
N$1: IR_RECEIVER1.VO SHIFT_REG4.4(F)
N$2: IR_RECEIVER2.VO SHIFT_REG4.3(E)
N$3: IR_RECEIVER3.VO SHIFT_REG4.6(H)
N$4: IR_RECEIVER4.VO SHIFT_REG4.5(G)
N$5: IR_RECEIVER5.VO SHIFT_REG4.12(B)
N$6: IR_RECEIVER6.VO SHIFT_REG4.11(A)
N$7: IR_RECEIVER7.VO SHIFT_REG4.14(D)
N$8: IR_RECEIVER8.VO SHIFT_REG4.13(C)
N$9: IR_RECEIVER25.VO SHIFT_REG7.4(F)
N$10: IR_RECEIVER26.VO SHIFT_REG7.3(E)
N$11: IR_RECEIVER27.VO SHIFT_REG7.6(H)
N$12: SHIFT_REG3.9(QH) SHIFT_REG4.10(SER)
N$13: IR_RECEIVER9.VO SHIFT_REG1.4(F)
N$14: IR_RECEIVER10.VO SHIFT_REG1.3(E)
N$15: IR_RECEIVER11.VO SHIFT_REG1.6(H)
N$16: IR_RECEIVER12.VO SHIFT_REG1.5(G)
N$17: IR_RECEIVER13.VO SHIFT_REG1.12(B)
N$18: IR_RECEIVER14.VO SHIFT_REG1.11(A)
N$19: IR_RECEIVER15.VO SHIFT_REG1.14(D)
N$20: IR_RECEIVER16.VO SHIFT_REG1.13(C)
N$21: IR_RECEIVER17.VO SHIFT_REG2.4(F)
N$22: IR_RECEIVER18.VO SHIFT_REG2.3(E)
N$23: IR_RECEIVER19.VO SHIFT_REG2.6(H)
N$24: IR_RECEIVER20.VO SHIFT_REG2.5(G)
N$25: IR_RECEIVER21.VO SHIFT_REG2.12(B)
N$26: IR_RECEIVER22.VO SHIFT_REG2.11(A)
N$27: IR_RECEIVER23.VO SHIFT_REG2.14(D)
N$28: IR_RECEIVER24.VO SHIFT_REG2.13(C)
N$30: IR_RECEIVER60.VO SHIFT_REG3.14(D)
N$32: SHIFT_REG1.9(QH) SHIFT_REG2.10(SER)
N$33: SHIFT_REG2.9(QH) SHIFT_REG3.10(SER)
N$35: IR_RECEIVER28.VO SHIFT_REG7.5(G)
N$36: IR_RECEIVER29.VO SHIFT_REG7.12(B)
N$37: IR_RECEIVER30.VO SHIFT_REG7.11(A)
N$38: IR_RECEIVER32.VO SHIFT_REG7.13(C)
N$39: IR_RECEIVER33.VO SHIFT_REG8.4(F)
N$40: IR_RECEIVER34.VO SHIFT_REG8.3(E)
N$41: IR_RECEIVER40.VO SHIFT_REG3.4(F)
N$42: IR_RECEIVER41.VO SHIFT_REG3.3(E)
N$43: IR_RECEIVER35.VO SHIFT_REG8.6(H)
N$44: IR_RECEIVER36.VO SHIFT_REG8.5(G)
N$45: IR_RECEIVER44.VO SHIFT_REG3.6(H)
N$46: IR_RECEIVER45.VO SHIFT_REG3.5(G)
N$47: IR_RECEIVER37.VO SHIFT_REG8.12(B)
N$48: IR_RECEIVER38.VO SHIFT_REG8.11(A)
N$49: IR_RECEIVER39.VO SHIFT_REG8.14(D)
N$50: IR_RECEIVER42.VO SHIFT_REG8.13(C)
N$51: SHIFT_REG7.9(QH) SHIFT_REG8.10(SER)
N$52: IR_RECEIVER43.VO SHIFT_REG5.4(F)
N$53: IR_RECEIVER46.VO SHIFT_REG5.3(E)
N$54: IR_RECEIVER47.VO SHIFT_REG5.6(H)
N$55: IR_RECEIVER48.VO SHIFT_REG5.5(G)
N$56: IR_RECEIVER49.VO SHIFT_REG5.12(B)
N$57: IR_RECEIVER56.VO SHIFT_REG3.12(B)
N$58: IR_RECEIVER57.VO SHIFT_REG3.11(A)
N$59: IR_RECEIVER50.VO SHIFT_REG5.11(A)
N$60: IR_RECEIVER51.VO SHIFT_REG5.14(D)
N$61: IR_RECEIVER52.VO SHIFT_REG5.13(C)
N$62: IR_RECEIVER61.VO SHIFT_REG3.13(C)
N$63: IR_RECEIVER53.VO SHIFT_REG6.4(F)
N$64: IR_RECEIVER54.VO SHIFT_REG6.3(E)
N$65: IR_RECEIVER55.VO SHIFT_REG6.6(H)
N$66: IR_RECEIVER58.VO SHIFT_REG6.5(G)
N$67: IR_RECEIVER59.VO SHIFT_REG6.12(B)
N$68: IR_RECEIVER62.VO SHIFT_REG6.11(A)
N$69: IR_RECEIVER63.VO SHIFT_REG6.14(D)
N$70: IR_RECEIVER64.VO SHIFT_REG6.13(C)
N$71: SHIFT_REG4.9(QH) SHIFT_REG5.10(SER)
N$72: IR_RECEIVER31.VO SHIFT_REG7.14(D)
N$74: SHIFT_REG5.9(QH) SHIFT_REG6.10(SER)
N$75: SHIFT_REG6.9(QH) SHIFT_REG7.10(SER)
SIG_IR: SHIFT_REG8.9(QH)
SIG_LED: port ADDR_LED11.SIG ADDR_LED12.SIG ADDR_LED9.SIG ADDR_LED10.SIG ADDR_LED15.SIG ADDR_LED16.SIG ADDR_LED13.SIG ADDR_LED14.SIG ADDR_LED19.SIG ADDR_LED20.SIG ADDR_LED17.SIG ADDR_LED18.SIG ADDR_LED23.SIG ADDR_LED24.SIG ADDR_LED21.SIG ADDR_LED22.SIG ADDR_LED45.SIG ADDR_LED46.SIG ADDR_LED41.SIG ADDR_LED42.SIG ADDR_LED61.SIG ADDR_LED62.SIG ADDR_LED57.SIG ADDR_LED58.SIG ADDR_LED3.SIG ADDR_LED4.SIG ADDR_LED1.SIG ADDR_LED2.SIG ADDR_LED7.SIG ADDR_LED8.SIG ADDR_LED5.SIG ADDR_LED6.SIG ADDR_LED47.SIG ADDR_LED48.SIG ADDR_LED43.SIG ADDR_LED44.SIG ADDR_LED51.SIG ADDR_LED52.SIG ADDR_LED49.SIG ADDR_LED50.SIG ADDR_LED55.SIG ADDR_LED56.SIG ADDR_LED53.SIG ADDR_LED54.SIG ADDR_LED63.SIG ADDR_LED64.SIG ADDR_LED59.SIG ADDR_LED60.SIG ADDR_LED27.SIG ADDR_LED28.SIG ADDR_LED25.SIG ADDR_LED26.SIG ADDR_LED31.SIG ADDR_LED32.SIG ADDR_LED29.SIG ADDR_LED30.SIG ADDR_LED35.SIG ADDR_LED36.SIG ADDR_LED33.SIG ADDR_LED34.SIG ADDR_LED39.SIG ADDR_LED40.SIG ADDR_LED37.SIG ADDR_LED38.SIG
Unconnected: SHIFT_REG1.1(SH/!LD) SHIFT_REG1.7(!QH) SHIFT_REG1.10(SER) SHIFT_REG2.1(SH/!LD) SHIFT_REG2.7(!QH) SHIFT_REG2.15(INH) SHIFT_REG3.1(SH/!LD) SHIFT_REG3.7(!QH) SHIFT_REG4.1(SH/!LD) SHIFT_REG4.7(!QH) SHIFT_REG4.15(INH) SHIFT_REG5.1(SH/!LD) SHIFT_REG5.7(!QH) SHIFT_REG6.1(SH/!LD) SHIFT_REG6.7(!QH) SHIFT_REG6.15(INH) SHIFT_REG7.1(SH/!LD) SHIFT_REG7.7(!QH) SHIFT_REG8.1(SH/!LD) SHIFT_REG8.7(!QH) SHIFT_REG8.15(INH)

## Notes on the sheet
- VCC
- GND
- VCC
- GND
- VCC
- GND
- VCC
- GND
- VCC
- GND
- VCC
- GND
- VCC
- GND
- VCC
- GND
- To Arduino
- +5V
- GND
- SIG_LED
- CLK
- CLK_INH
- SH/LD
- SIG_IR

## Power pins joined to a net without a drawn wire
GND: SHIFT_REG1.8(GND) SHIFT_REG2.8(GND) SHIFT_REG3.8(GND) SHIFT_REG4.8(GND) SHIFT_REG5.8(GND) SHIFT_REG6.8(GND) SHIFT_REG7.8(GND) SHIFT_REG8.8(GND)
VCC: SHIFT_REG1.16(VCC) SHIFT_REG2.16(VCC) SHIFT_REG3.16(VCC) SHIFT_REG4.16(VCC) SHIFT_REG5.16(VCC) SHIFT_REG6.16(VCC) SHIFT_REG7.16(VCC) SHIFT_REG8.16(VCC)

## Library data of the parts
IR_DIODE1-IR_DIODE64 = led:SFH482: IR LED infrared emitting diode, Infineon
IR_RECEIVER1-IR_RECEIVER64 = telefunken:TSOP17*TB1: TSOP17..TB1 IR Receiver Modules for Remote Control Systems Source: http://www.vishay.com/docs/82042/82042.pdf; OC_FARNELL: unknown; OC_NEWARK: unknown
SHIFT_REG1-SHIFT_REG8 = 74xx-eu:74*165: 8-bit parallel load SHIFT REGISTER

## Module ADDR_LED
Ports: +5V(pwr) GND(pwr) SIG(in)
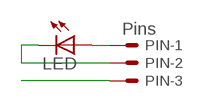
[diagram p5: schematic, module ADDR_LED, sheet 1]

### Parts
LED  LEDSQR2X5  [LED2X5]
PIN  Pins  22-23-2031  [22-23-2031]

### Nets
+5V: LED.A PIN.1
GND: LED.K(C) PIN.2
SIG: PIN.3

### Library data of the parts
LED = led:LED: LED OSRAM: - CHIPLED LG R971, LG N971, LY N971, LG Q971, LY Q971, LO R971, LY R971 LH N974, LH R974 LS Q976, LO Q976, LY Q976 LO Q996 - Hyper CHIPLED LW Q18S LB Q993, LB Q99A, LB R99A - SideLED LS A670, LO A670, LY A670, LG A670, LP A670 LB A673, LV A673, LT A673, LW A673 LH A674 LY A675 LS A676, LA A676, LO A676, LY A676, LW A676 LS A679, LY A679, LG A679 - Hyper Micro SIDELED® LS Y876, LA Y876, LO Y876, LY Y876 LT Y87S - SmartLED LW L88C, LW L88S LB L89C, LB L89S, LG L890 LS L89K, LO L89K, LY L89K LS L896, LA L896, LO L896, LY L896 - TOPLED LS T670, LO T670, LY T670, LG T670, LP T670 LSG T670, LSP T670, LSY T670, LOP T670, LYG T670 LG T671, LOG T671, LSG T671 LB T673, LV T673, LT T673, LW T673 LH T674 LS T676, LA T676, LO T676, LY T676, LB T676, LH T676, LSB T676, LW T676 LB T67C, LV T67C, LT T67C, LS T67K, LO T67K, LY T67K, LW E67C LS E67B, LA E67B, LO E67B, LY E67B, LB E67C, LV E67C, LT E67C LW T67C LS T679, LY T679, LG T679 LS T770, LO T770, LY T770, LG T770, LP T770 LB T773, LV T773, LT T773, LW T773 LH T774 LS E675, LA E675, LY E675, LS T675 LS T776, LA T776, LO T776, LY T776, LB T776 LHGB T686 LT T68C, LB T68C - Hyper Mini TOPLED® LB M676 - Mini TOPLED Santana® LG M470 LS M47K, LO M47K, LY M47K Source: http://www.osram.convergy.de LUXEON: - LUMILED® LXK2-PW12-R00, LXK2-PW12-S00, LXK2-PW14-U00, LXK2-PW14-V00 LXK2-PM12-R00, LXK2-PM12-S00, LXK2-PM14-U00 LXK2-PE12-Q00, LXK2-PE12-R00, LXK2-PE12-S00, LXK2-PE14-T00, LXK2-PE14-U00 LXK2-PB12-K00, LXK2-PB12-L00, LXK2-PB12-M00, LXK2-PB14-N00, LXK2-PB14-P00, LXK2-PB14-Q00 LXK2-PR12-L00, LXK2-PR12-M00, LXK2-PR14-Q00, LXK2-PR14-R00 LXK2-PD12-Q00, LXK2-PD12-R00, LXK2-PD12-S00 LXK2-PH12-R00, LXK2-PH12-S00 LXK2-PL12-P00, LXK2-PL12-Q00, LXK2-PL12-R00 Source: www.luxeon.com KINGBRIGHT: KA-3528ASYC Source: www.kingbright.com
PIN = con-molex:22-23-2031: .100" (2.54mm) Center Header - 3 Pin; MF: MOLEX; MPN: 22-23-2031; OC_FARNELL: 1462950; OC_NEWARK: 30C0862